# Altium schematic sheet ENC28j60 Ethernet.SchDoc
size A
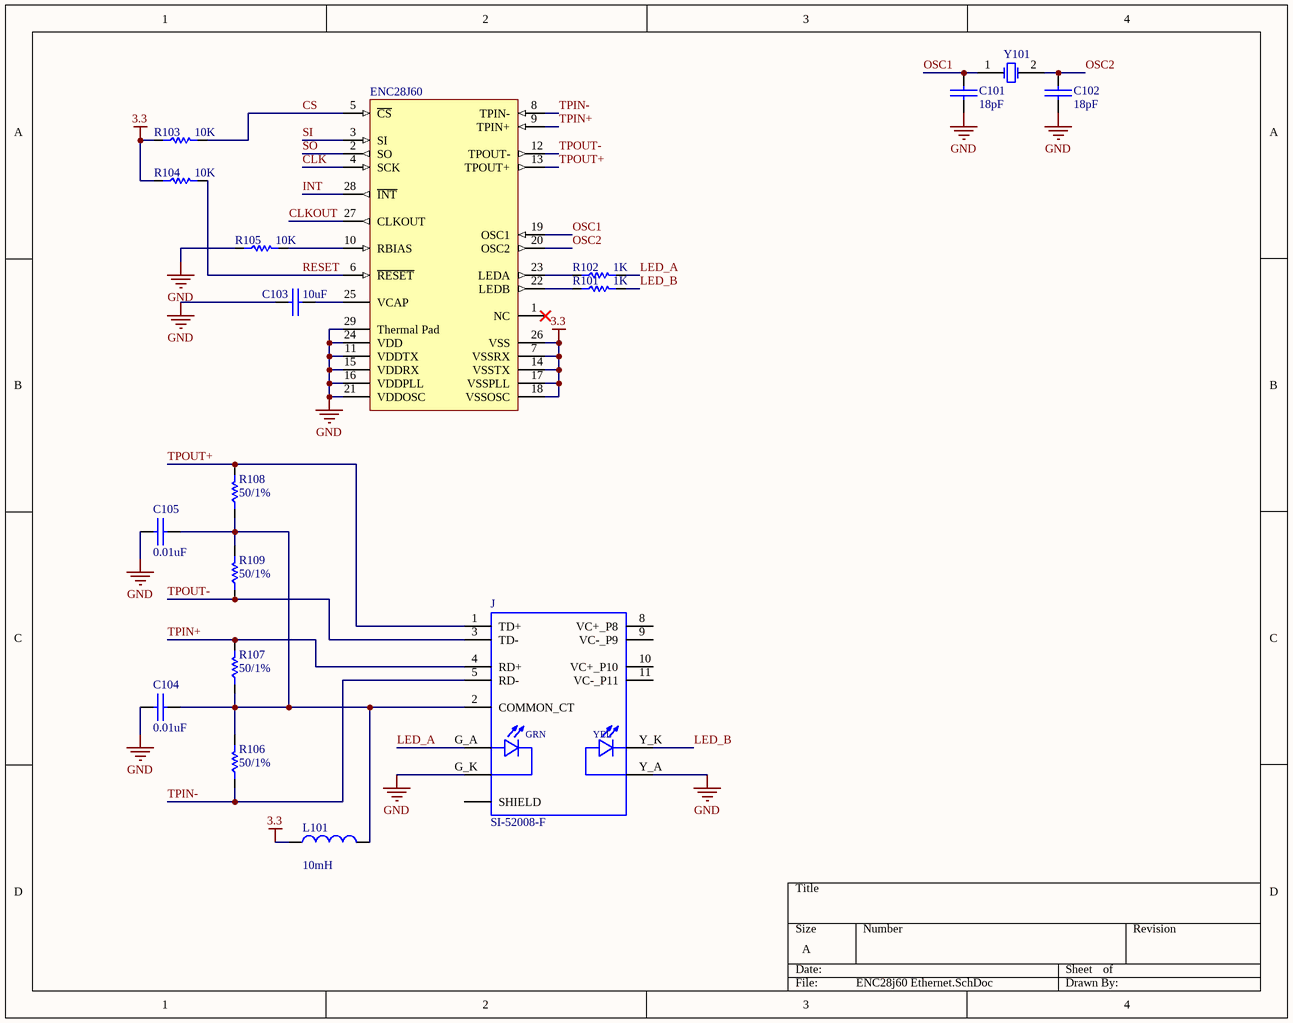
[diagram p0: ENC28j60 Ethernet.SchDoc]

## Parts
C101  18pF  [SMD_CAP_0805]
C102  18pF  [SMD_CAP_0805]
C103  10uF  [SMD_CAP_0805]
C104  0.01uF  [SMD_CAP_0805]
C105  0.01uF  [SMD_CAP_0805]
ENC28J60  ENC28J60/ML  [QFN-ML28_L]  (value not drawn)
J  SI-52008-F  [BEL_SI-52008-F]
L101  value 10mH  [INDC1608L]  (hidden comment: Inductor)
R101  1K  [RES 0805 (2012X06L)]
R102  1K  [RES 0805 (2012X06L)]
R103  10K  [RES 0805 (2012X06L)]
R104  10K  [RES 0805 (2012X06L)]
R105  10K  [RES 0805 (2012X06L)]
R106  50/1%  [RES 0805 (2012X06L)]
R107  50/1%  [RES 0805 (2012X06L)]
R108  50/1%  [RES 0805 (2012X06L)]
R109  50/1%  [RES 0805 (2012X06L)]
Y101  11.0592 MHz  [Crystal SMD]  (value not drawn)

## Nets
3.3: ENC28J60.7(VSSRX) ENC28J60.14(VSSTX) ENC28J60.17(VSSPLL) ENC28J60.18(VSSOSC) ENC28J60.26(VSS) L101.1 R103.1 R104.1
GND: C101.2(-) C102.2(-) C103.1(+) C104.1(+) C105.1(+) ENC28J60.11(VDDTX) ENC28J60.15(VDDRX) ENC28J60.16(VDDPLL) ENC28J60.21(VDDOSC) ENC28J60.24(VDD) ENC28J60.29(Thermal_Pad) J.G_K J.Y_A R105.1
CLK: ENC28J60.4(SCK)
CLKOUT: ENC28J60.27(CLKOUT)
CS: ENC28J60.5(~{CS}) R103.2
INT: ENC28J60.28(~{INT})
LED_A: J.G_A R102.2
LED_B: J.Y_K R101.2
OSC1: C101.1(+) ENC28J60.19(OSC1) Y101.1(OSC1)
OSC2: C102.1(+) ENC28J60.20(OSC2) Y101.2(OSC2)
RESET: ENC28J60.6(~{RESET}) R104.2
SI: ENC28J60.3(SI)
SO: ENC28J60.2(SO)
TPIN+: ENC28J60.9(TPIN+) J.4(RD+) R107.2
TPIN-: ENC28J60.8(TPIN-) J.5(RD-) R106.1
TPOUT+: ENC28J60.13(TPOUT+) J.1(TD+) R108.2
TPOUT-: ENC28J60.12(TPOUT-) J.3(TD-) R109.1
NetC103_2: C103.2(-) ENC28J60.25(VCAP)
NetC104_2: C104.2(-) C105.2(-) J.2(COMMON_CT) L101.2 R106.2 R107.1 R108.1 R109.2
NetENC28J60_10: ENC28J60.10(RBIAS) R105.2
NetENC28J60_22: ENC28J60.22(LEDB) R101.1
NetENC28J60_23: ENC28J60.23(LEDA) R102.1
NetJ_S1: J.S1(SHIELD) J.S2(SHIELD)

Not connected (* = marked no-connect by the designer): ENC28J60 1(NC)*; J 8(VC+_P8) 9(VC-_P9) 10(VC+_P10) 11(VC-_P11)

## Notes on the sheet
- (in symbol SI-52008-F) GRN; YEL

## Library data of the parts
C101-C105 = Cap-Bipolar: Bipolar Capacitor; Voltage: 100V; Designer: Saeid Jorablo; Organazation: ControTec; Adding Date: 1387/12/20
  C101 C102: Value: 18pF
  C103: Value: 10uF
  C104 C105: Value: 0.01uF
ENC28J60 = ENC28J60/ML: Stand-Alone Ethernet Controller with SPI Interface, 28-Pin QFN; Manufacturer: Microchip; DatasheetVersion: revC, Jan-2008; PackageVersion: revBB, Aug-2009; PackageReference: QFN-ML28; PackageDescription: 28-Lead Plastic Quad Flat, No Lead Package (ML) - 6x6 mm Body [QFN] with 0.55 mm Contact Length; Supplier 1: Digi-Key; Supplier Part Number 1: ENC28J60/ML-ND; Supplier 2: Mouser; Supplier Part Number 2: 579-ENC28J60/ML; Mounting Technology: Surface Mount; Code_JEDEC: MO-220; PartNumber: ENC28J60/ML; ComponentLink1Description: Manufacturer URL; ComponentLink1URL: http://www.microchip.com/; ComponentLink2Description: Datasheet; ComponentLink2URL: http://ww1.microchip.com/downloads/en/DeviceDoc/39662c.pdf; ComponentLink3Description: Package Specification; ComponentLink3URL: http://www.microchip.com/stellent/groups/techpub_sg/documents/packagingspec/en012702.pdf
J = SI-52008-F: 1 Port RJ45 Magjack Connector Through Hole 10/100 Base-T, AutoMDIX, Power over Ethernet _PoE_; MF: Stewart Connector; Availability: Unavailable; MP: SI-52008-F; Price: None; Value: *; SnapEDA_Link: https://www.snapeda.com/parts/SI-52008-F/Stewart%20Connector/view-part/214280/?ref=snap; Package: None
L101 = Inductor: Code_IEC: 1005; Published: 8-Jun-2000; LatestRevisionDate: 29-May-2009; LatestRevisionNote: IPC-7351 Footprint Added.; PackageReference: 0402-A; Publisher: Altium Limited; PackageDescription: Chip Inductor; Code_JEITA: 0402
R101-R109 = Resistor: Tolerance: 5%; Power: 1/8 W
  R101 R102: Value: 1K
  R103-R105: Value: 10K
  R106-R109: Value: 50/1%
Y101 = XTAL: XTAL Crystal; Company: E.P.I.L; Design Date: 11/04/2011; Value: 11.0592 MHz